# EAGLE schematic FSStation (EAGLE 6.1)
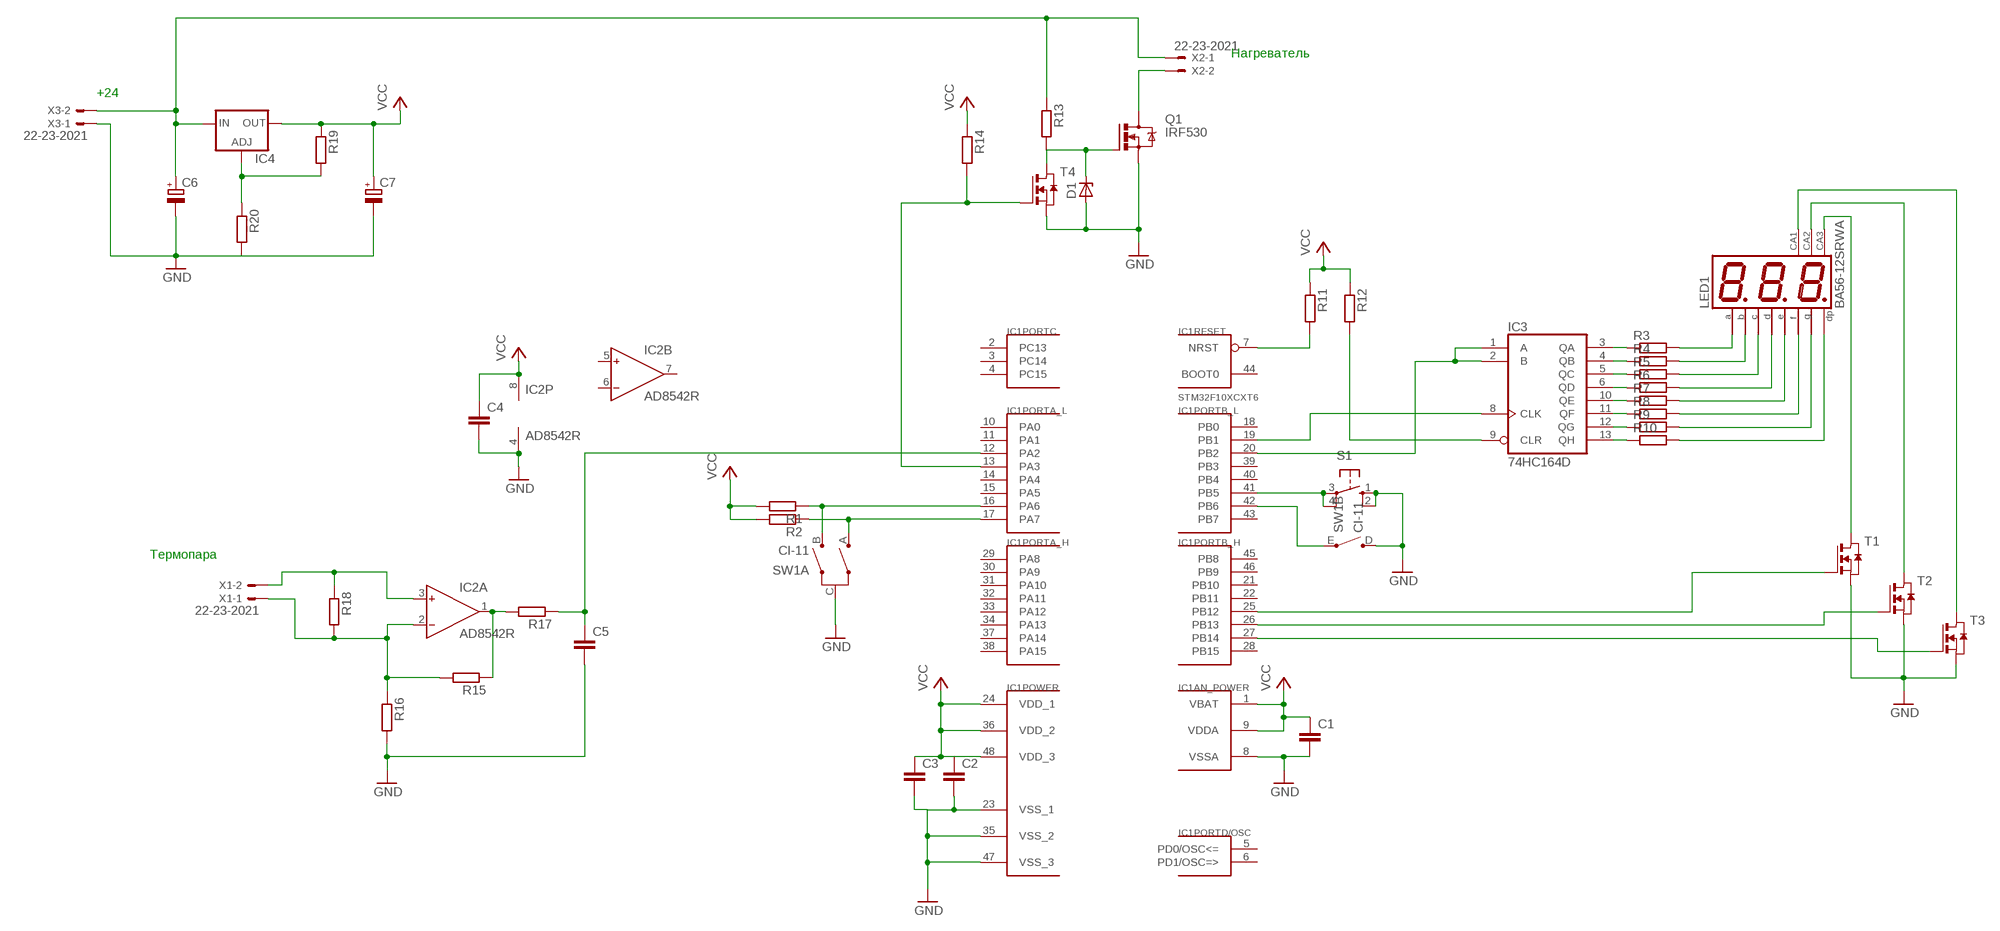
[diagram p0: schematic, sheet 1]

## Parts
C1  C-EUC0805  [C0805]
C2  C-EUC0805  [C0805]
C3  C-EUC0805  [C0805]
C4  C-EUC0805  [C0805]
C5  C-EUC0805  [C0805]
C6  CPOL-EUE2.5-5  [E2,5-5]
C7  CPOL-EUE2.5-5  [E2,5-5]
D1  ZENER-DIODEDO34-7  [DO34Z7]
IC1  STM32F10XCXT6  [TQFP48]
IC2  AD8542R  [SO8]
IC3  74HC164D  [SO14]
IC4  LM317TS  [317TS]
LED1  BA56-12SRWA  [BX56-12]
Q1  IRF530  [TO220BV]
R1  R-EU_R0805  [R0805]
R2  R-EU_R0805  [R0805]
R3  R-EU_R0805  [R0805]
R4  R-EU_R0805  [R0805]
R5  R-EU_R0805  [R0805]
R6  R-EU_R0805  [R0805]
R7  R-EU_R0805  [R0805]
R8  R-EU_R0805  [R0805]
R9  R-EU_R0805  [R0805]
R10  R-EU_R0805  [R0805]
R11  R-EU_R0805  [R0805]
R12  R-EU_R0805  [R0805]
R13  R-EU_R0805  [R0805]
R14  R-EU_R0805  [R0805]
R15  R-EU_R0805  [R0805]
R16  R-EU_R0805  [R0805]
R17  R-EU_R0805  [R0805]
R18  R-EU_R0805  [R0805]
R19  R-EU_R0805  [R0805]
R20  R-EU_R0805  [R0805]
S1  40-XX  [B3F-40XX]
SW1  CI-11  [CI-11]
T1  NMOSSOT23  [SOT-23]
T2  NMOSSOT23  [SOT-23]
T3  NMOSSOT23  [SOT-23]
T4  NMOSSOT23  [SOT-23]
X1  22-23-2021  [22-23-2021]
X2  22-23-2021  [22-23-2021]
X3  22-23-2021  [22-23-2021]

## Nets
GND: C1.2 C2.2 C3.2 C4.2 C5.2 C6.- C7.- D1.A IC1.8(AN_POWER:VSSA) IC1.23(POWER:VSS_1) IC1.35(POWER:VSS_2) IC1.47(POWER:VSS_3) IC2.4(P:V-) Q1.S R16.2 R20.2 S1.1(S) S1.2(S1) SW1.C(A:C) SW1.D(B:D) T1.2(S) T2.2(S) T3.2(S) T4.2(S) X3.1
N$1: IC3.3(QA) R3.1
N$2: IC3.4(QB) R4.1
N$3: IC3.5(QC) R5.1
N$4: IC3.6(QD) R6.1
N$5: IC3.10(QE) R7.1
N$6: IC3.11(QF) R8.1
N$7: IC3.12(QG) R9.1
N$8: IC3.13(QH) R10.1
N$9: LED1.11(A) R3.2
N$10: LED1.7(B) R4.2
N$11: LED1.4(C) R5.2
N$12: LED1.2(D) R6.2
N$13: LED1.1(E) R7.2
N$14: LED1.10(F) R8.2
N$15: LED1.5(G) R9.2
N$16: LED1.3(DP) R10.2
N$17: LED1.12(CA) T3.1(D)
N$18: LED1.9(CA) T2.1(D)
N$19: LED1.8(CA) T1.1(D)
N$20: IC1.25(PORTB_H:PB12) T1.3(G)
N$21: IC1.26(PORTB_H:PB13) T2.3(G)
N$22: IC1.27(PORTB_H:PB14) T3.3(G)
N$24: D1.C Q1.G R13.2 T4.1(D)
N$25: IC1.19(PORTB_L:PB1) IC3.8(CLK)
N$26: IC1.20(PORTB_L:PB2) IC3.1(A) IC3.2(B)
N$27: IC1.13(PORTA_L:PA3) R14.2 T4.3(G)
N$28: IC1.7(RESET:NRST) R11.2
N$29: IC1.41(PORTB_L:PB5) S1.3(P) S1.4(P1)
N$30: IC1.42(PORTB_L:PB6) SW1.E(B:E)
N$31: IC2.2(A:IN-) R15.2 R16.1 R18.2 X1.1
N$32: IC3.9(CLR) R12.2
N$33: IC2.3(A:IN+) R18.1 X1.2
N$34: IC2.1(A:OUT) R15.1 R17.2
N$35: IC1.17(PORTA_L:PA7) R2.1 SW1.A(A:A)
N$36: IC1.16(PORTA_L:PA6) R1.1 SW1.B(A:B)
N$37: C5.1 IC1.12(PORTA_L:PA2) R17.1
N$40: Q1.D X2.2
N$41: C6.+ IC4.3(IN) R13.1 X2.1 X3.2
N$44: IC4.1(ADJ) R19.2 R20.1
VCC: C1.1 C3.1 C4.1 C7.+ IC1.1(AN_POWER:VBAT) IC1.9(AN_POWER:VDDA) IC1.24(POWER:VDD_1) IC1.36(POWER:VDD_2) IC1.48(POWER:VDD_3) IC2.8(P:V+) IC4.2(OUT) R1.2 R2.2 R11.1 R12.1 R14.1 R19.1
Unconnected: C2.1 IC1.2(PORTC:PC13) IC1.3(PORTC:PC14) IC1.4(PORTC:PC15) IC1.5(PORTD/OSC:PD0/OSC<=) IC1.6(PORTD/OSC:PD1/OSC=>) IC1.10(PORTA_L:PA0) IC1.11(PORTA_L:PA1) IC1.14(PORTA_L:PA4) IC1.15(PORTA_L:PA5) IC1.18(PORTB_L:PB0) IC1.21(PORTB_H:PB10) IC1.22(PORTB_H:PB11) IC1.28(PORTB_H:PB15) IC1.29(PORTA_H:PA8) IC1.30(PORTA_H:PA9) IC1.31(PORTA_H:PA10) IC1.32(PORTA_H:PA11) IC1.33(PORTA_H:PA12) IC1.34(PORTA_H:PA13) IC1.37(PORTA_H:PA14) IC1.38(PORTA_H:PA15) IC1.39(PORTB_L:PB3) IC1.40(PORTB_L:PB4) IC1.43(PORTB_L:PB7) IC1.44(RESET:BOOT0) IC1.45(PORTB_H:PB8) IC1.46(PORTB_H:PB9) IC2.5(B:IN+) IC2.6(B:IN-) IC2.7(B:OUT)

## Notes on the sheet
- Нагреватель
- +24
- Термопара

## Power pins joined to a net without a drawn wire
GND: IC3.7(GND)
VCC: IC3.14(VCC)

## Library data of the parts
C1-C5 = rcl:C-EU: CAPACITOR, European symbol
C6 C7 = rcl:CPOL-EU: POLARIZED CAPACITOR, European symbol
D1 = diode:ZENER-DIODE: Z-Diode
IC1 = stm32:STM32F10XCXT6: ST STM32F101/103 48pin LQFP
IC2 = analog-devices:AD8542: General-Purpose CMOS Rail-to-Rail Amplifiers Source: http://www.analog.com/static/imported-files/data_sheets/AD8541_8542_8544.pdf; MF: ALTERA CORPORATION; MPN: AD8542ARZ-REEL; OC_FARNELL: 1424150; OC_NEWARK: 59K6827
IC3 = 74xx-eu:74*164: 8-bit parallel out SHIFT REGISTER
IC4 = v-reg:LM317TS: VOLTAGE REGULATOR
LED1 = display-kingbright:B?56-12*WA: 14.22mm (0.56INCH) THREE DIGIT NUMERIC DISPLAY Source: http://www.kingbright.com .. BA56-11EWA(Ver1189474895.pdf; OC_FARNELL: unknown; OC_NEWARK: unknown
Q1 = transistor-power:IRF530: HEXFET Power MOSFET
R1-R20 = rcl:R-EU_: RESISTOR, European symbol
S1 = switch-omron:40-XX: OMRON SWITCH; MF: OMRON COMPONENTS USA; MPN: B3F-4000; OC_FARNELL: 176434; OC_NEWARK: 36K3105
SW1 = piher:CI-11: 11mm Incemental Encoder Source: www.piher.net .. 04-CI-11v04.pdf; OC_FARNELL: unknown; OC_NEWARK: unknown
T1-T4 = zetex:NMOSSOT23: MOS FET; OC_FARNELL: unknown; OC_NEWARK: unknown
X1-X3 = con-molex:22-23-2021: .100" (2.54mm) Center Header - 2 Pin; MF: MOLEX; MPN: 22-23-2021; OC_FARNELL: 1462926; OC_NEWARK: 25C3832